# EAGLE schematic BusBoard (EAGLE 7.4.0)
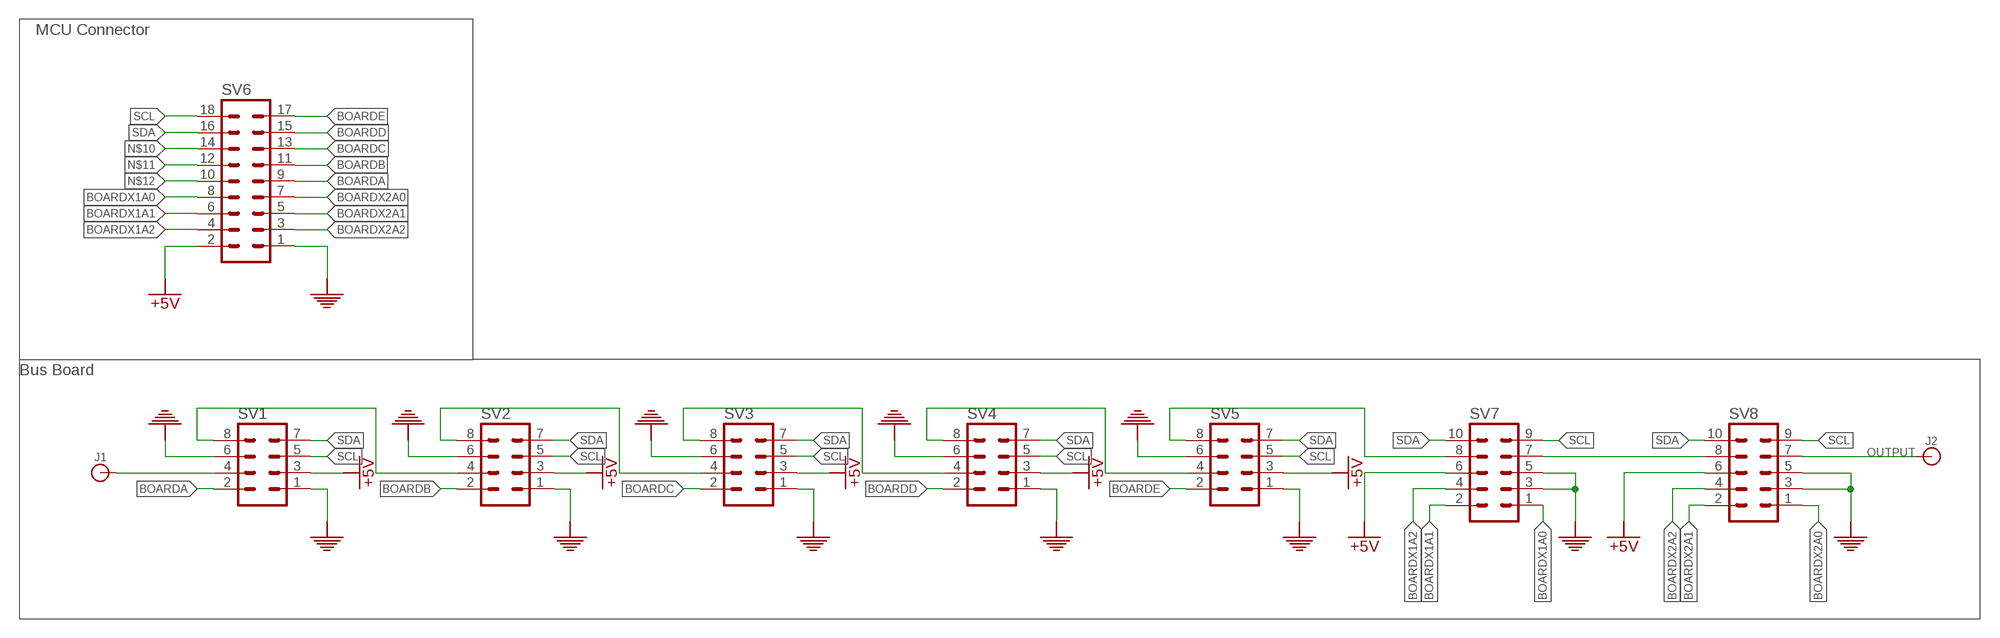
[diagram p0: schematic, sheet 1]

## Parts
J1  BANANA_CONN  [BANANA_CONN]
J2  BANANA_CONN  [BANANA_CONN]
SV1  MA04-2  [MA04-2]
SV2  MA04-2  [MA04-2]
SV3  MA04-2  [MA04-2]
SV4  MA04-2  [MA04-2]
SV5  MA04-2  [MA04-2]
SV6  MA09-2  [MA09-2]
SV7  MA05-2  [MA05-2]
SV8  MA05-2  [MA05-2]

## Nets
+5V: SV1.3 SV2.3 SV3.3 SV4.3 SV5.3 SV6.2 SV7.6 SV8.6
BOARDA: SV1.2 SV6.9
BOARDB: SV2.2 SV6.11
BOARDC: SV3.2 SV6.13
BOARDD: SV4.2 SV6.15
BOARDE: SV5.2 SV6.17
BOARDX1A0: SV6.8 SV7.1
BOARDX1A1: SV6.6 SV7.2
BOARDX1A2: SV6.4 SV7.4
BOARDX2A0: SV6.7 SV8.1
BOARDX2A1: SV6.5 SV8.2
BOARDX2A2: SV6.3 SV8.4
GND: SV1.1 SV1.6 SV2.1 SV2.6 SV3.1 SV3.6 SV4.1 SV4.6 SV5.1 SV5.6 SV6.1 SV7.3 SV7.5 SV8.3 SV8.5
N$9: SV1.8 SV2.4
N$10: SV6.14
N$11: SV6.12
N$12: SV6.10
N$18: SV2.8 SV3.4
N$19: SV3.8 SV4.4
N$20: SV4.8 SV5.4
N$21: SV5.8 SV7.8
N$22: J1.P$1 SV1.4
OUTPUT: J2.P$1 SV8.7
OUTPUT5: SV7.7 SV8.8
SCL: SV1.5 SV2.5 SV3.5 SV4.5 SV5.5 SV6.18 SV7.9 SV8.9
SDA: SV1.7 SV2.7 SV3.7 SV4.7 SV5.7 SV6.16 SV7.10 SV8.10

## Notes on the sheet
- MCU Connector
- Bus Board

## Library data of the parts
J1 J2 = SparkFun:BANANA_CONN
SV1-SV5 = con-lstb:MA04-2: PIN HEADER; OC_FARNELL: unknown; OC_NEWARK: unknown
SV6 = con-lstb:MA09-2: PIN HEADER; OC_FARNELL: unknown; OC_NEWARK: unknown
SV7 SV8 = con-lstb:MA05-2: PIN HEADER; OC_FARNELL: unknown; OC_NEWARK: unknown